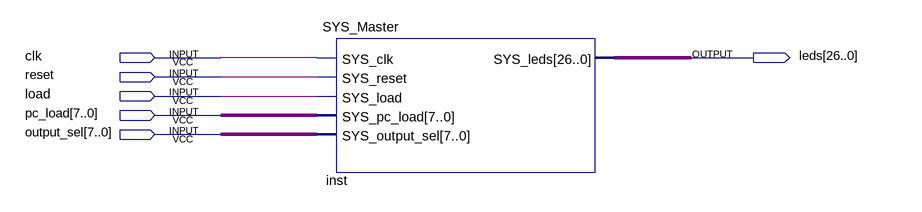
[diagram p0: schematic sheet]
// Quartus schematic Block2.bdf as structural Verilog: 1 symbols, 6 pins
module Block2 (
  input  clk,
  input  reset,
  input  load,
  input  [7:0] pc_load,
  input  [7:0] output_sel,
  output [26:0] leds
);

  SYS_Master inst (
    .SYS_clk(clk), .SYS_reset(reset), .SYS_load(load), .SYS_pc_load(pc_load), .SYS_output_sel(output_sel),
    .SYS_leds(leds));
endmodule
